# Altium schematic sheet 国赛f407vet6主控板原理图（6.26）.SchDoc
size A2
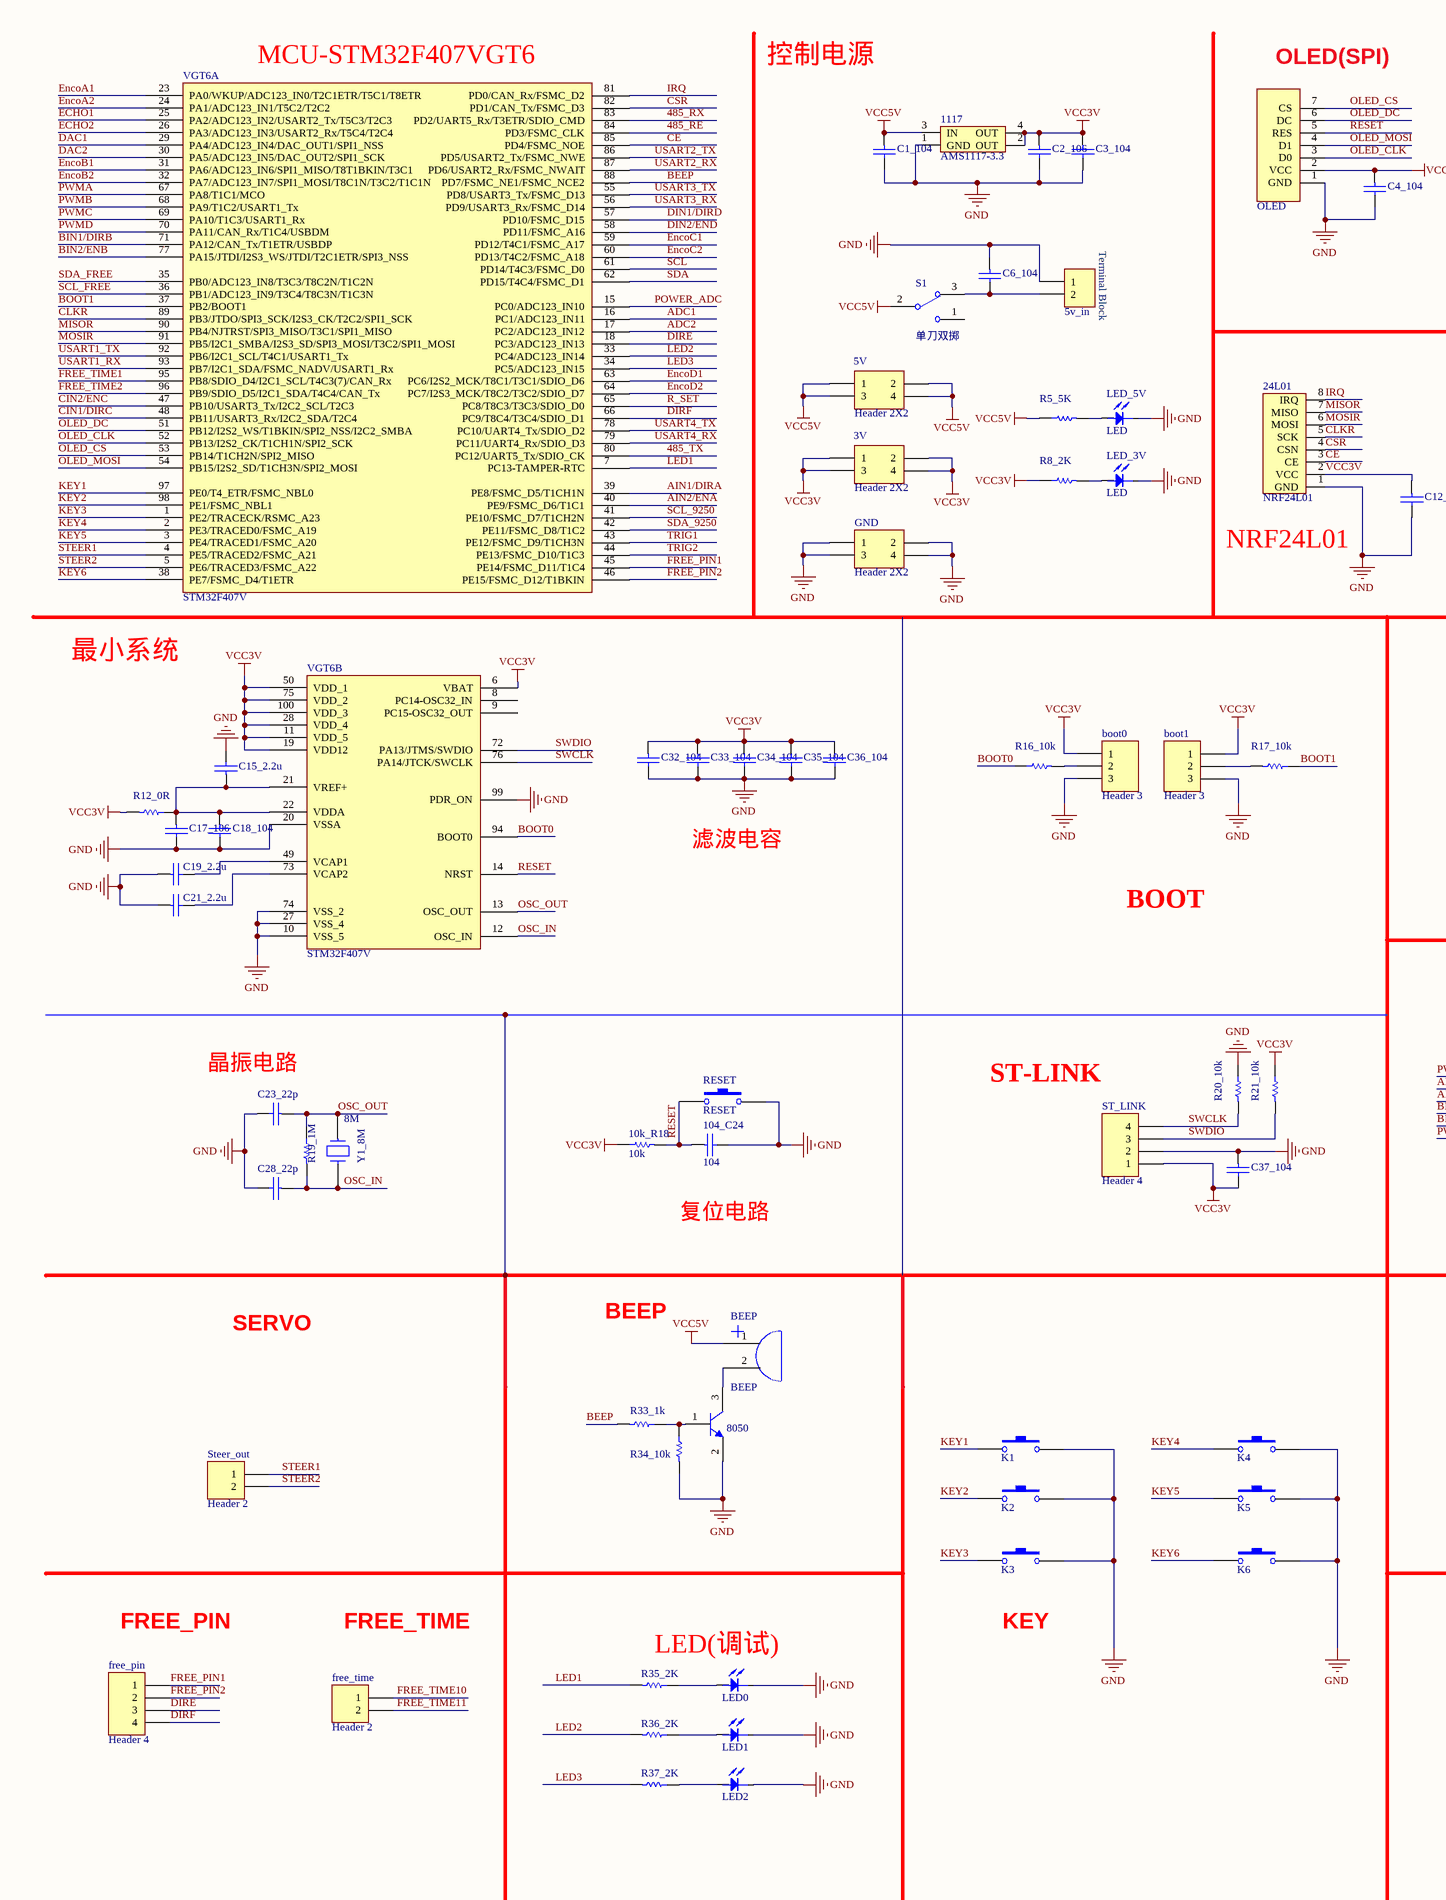
[diagram p0: 国赛f407vet6主控板原理图（6.26）.SchDoc, left]
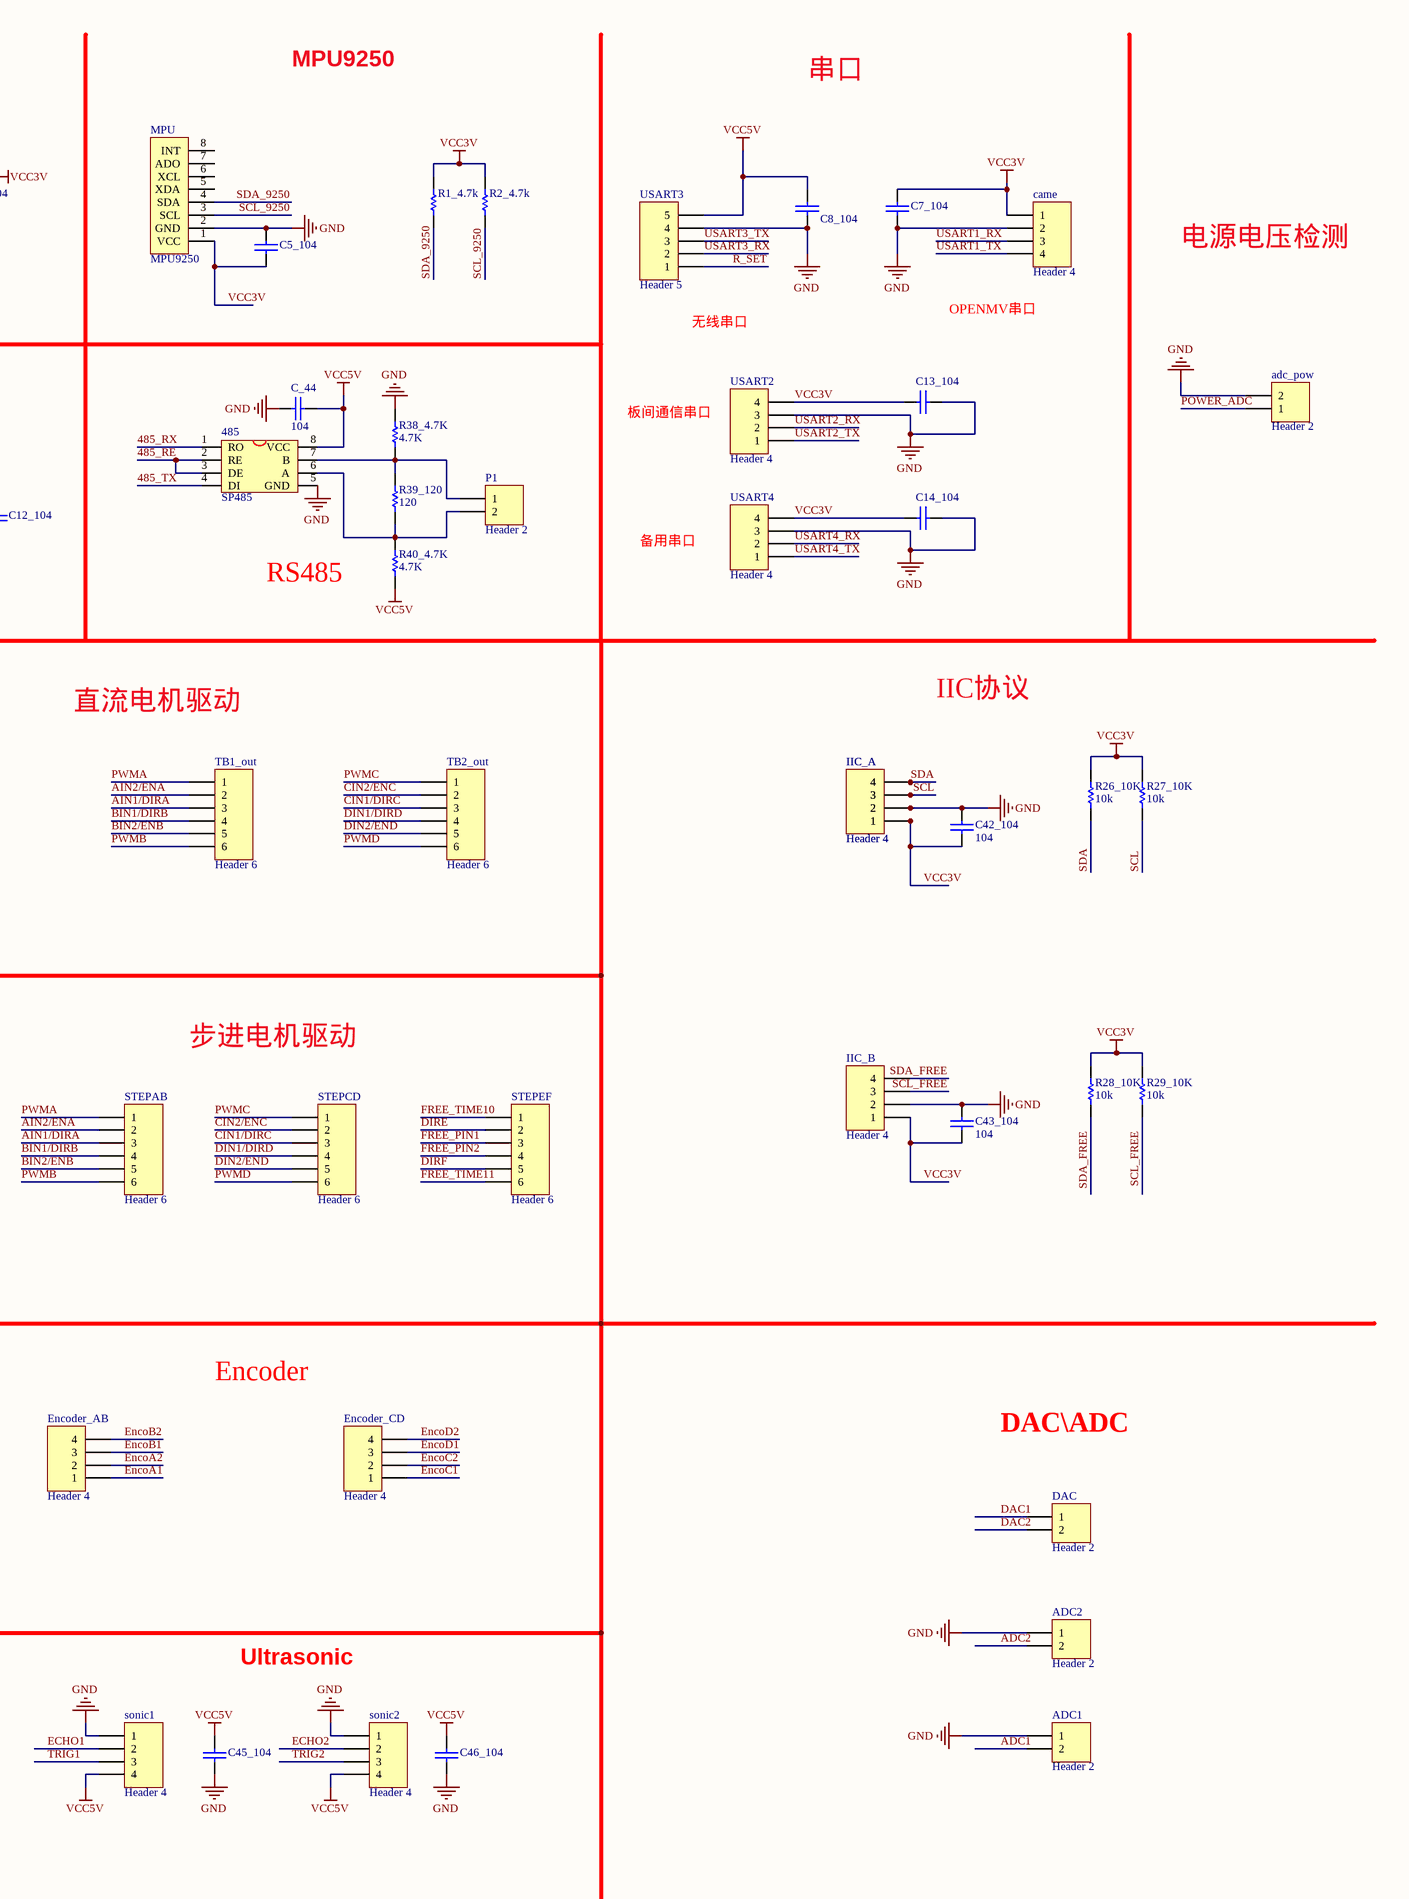
[diagram p1: 国赛f407vet6主控板原理图（6.26）.SchDoc, right]

## Parts
(Parts that share a designator on the sheet are numbered #1, #2 ... from top to bottom, then left to right.)
3V  Header 2X2  [HDR2X2]
5V  Header 2X2  [HDR2X2]
5v_in  Terminal Block 2P  [XH2.54-WS-2P]  (value not drawn)
10k_R18  RES  [0805_C]  (value not drawn)
24L01  NRF24L01  [HDR2X4]
104_C24  104  [0805_C]
485  SP485  [sop8]
1117  AMS1117-3.3  [SOT223]
8050  NPN  [SOT-23Q]  (value not drawn)
ADC1  Header 2  [XH2.54-WS-2P]
ADC2  Header 2  [XH2.54-WS-2P]
adc_pow  Header 2  [XH2.54-WS-2P]
BEEP  BEEP  [BUZZER_12.0X8.5MM]
boot0  Header 3  [HDR1X3]
boot1  Header 3  [HDR1X3]
C1_104  CAP  [0805_C]  (value not drawn)
C2_106  CAP  [0805_C]  (value not drawn)
C3_104  CAP  [0805_C]  (value not drawn)
C4_104  CAP  [0805_C]  (value not drawn)
C5_104  CAP  [0805_C]  (value not drawn)
C6_104  CAP  [0805_C]  (value not drawn)
C7_104  CAP  [0805_C]  (value not drawn)
C8_104  CAP  [0805_C]  (value not drawn)
C12_104  CAP  [0805_C]  (value not drawn)
C13_104  CAP  [0805_C]  (value not drawn)
C14_104  CAP  [0805_C]  (value not drawn)
C15_2.2u  CAP  [0805_C]  (value not drawn)
C17_106  CAP  [0805_C]  (value not drawn)
C18_104  CAP  [0805_C]  (value not drawn)
C19_2.2u  CAP  [0805_C]  (value not drawn)
C21_2.2u  CAP  [0805_C]  (value not drawn)
C23_22p  CAP  [0805_C]  (value not drawn)
C28_22p  CAP  [0805_C]  (value not drawn)
C32_104  CAP  [0805_C]  (value not drawn)
C33_104  CAP  [0805_C]  (value not drawn)
C34_104  CAP  [0805_C]  (value not drawn)
C35_104  CAP  [0805_C]  (value not drawn)
C36_104  CAP  [0805_C]  (value not drawn)
C37_104  CAP  [0805_C]  (value not drawn)
C42_104  value 104  [0805_C]  (hidden comment: CAP)
C43_104  value 104  [0805_C]  (hidden comment: CAP)
C45_104  CAP  [0805_C]  (value not drawn)
C46_104  CAP  [0805_C]  (value not drawn)
C_44  value 104  [0805_C]  (hidden comment: CAP)
came  Header 4  [XH2.54-WS-4P]
DAC  Header 2  [XH2.54-WS-2P]
Encoder_AB  Header 4  [XH2.54-WS-4P]
Encoder_CD  Header 4  [XH2.54-WS-4P]
free_pin  Header 4  [XH2.54-WS-4P]
free_time  Header 2  [XH2.54-WS-2P]
GND  Header 2X2  [HDR2X2]
IIC_A#1  Header 4  [XH2.54-WS-4P]
IIC_A#2  Header 4  [XH2.54-WS-4P]
IIC_B  Header 4  [XH2.54-WS-4P]
K1  KEY  [KEY-SMD]  (value not drawn)
K2  KEY  [KEY-SMD]  (value not drawn)
K3  KEY  [KEY-SMD]  (value not drawn)
K4  KEY  [KEY-SMD]  (value not drawn)
K5  KEY  [KEY-SMD]  (value not drawn)
K6  KEY  [KEY-SMD]  (value not drawn)
LED0  LED  [0805-LED]  (value not drawn)
LED1  LED  [0805-LED]  (value not drawn)
LED2  LED  [0805-LED]  (value not drawn)
LED_3V  LED  [0805-LED]
LED_5V  LED  [0805-LED]
MPU  MPU9250  [HDR1X4]
OLED  OLED  [HDR1X7]  (value not drawn)
P1  Header 2  [XH2.54-WS-2P]
R1_4.7k  RES  [0805_R]  (value not drawn)
R2_4.7k  RES  [0805_R]  (value not drawn)
R5_5K  RES  [0805_R]  (value not drawn)
R8_2K  RES  [0805_R]  (value not drawn)
R12_0R  RES  [0805_R]  (value not drawn)
R16_10k  RES  [0805_R]  (value not drawn)
R17_10k  RES  [0805_R]  (value not drawn)
R19_1M  RES  [0805_R]  (value not drawn)
R20_10k  RES  [0805_R]  (value not drawn)
R21_10k  RES  [0805_R]  (value not drawn)
R26_10K  value 10k  [0805_R]  (hidden comment: RES)
R27_10K  value 10k  [0805_R]  (hidden comment: RES)
R28_10K  value 10k  [0805_R]  (hidden comment: RES)
R29_10K  value 10k  [0805_R]  (hidden comment: RES)
R33_1k  RES  [0805_R]  (value not drawn)
R34_10k  RES  [0805_R]  (value not drawn)
R35_2K  RES  [0805_R]  (value not drawn)
R36_2K  RES  [0805_R]  (value not drawn)
R37_2K  RES  [0805_R]  (value not drawn)
R38_4.7K  value 4.7K  [0805_R]  (hidden comment: RES)
R39_120  value 120  [0805_R]  (hidden comment: RES)
R40_4.7K  value 4.7K  [0805_R]  (hidden comment: RES)
RESET  RESET  [KEY-SMD]
S1  单刀双掷  [SWITCH_3F_SPDT - 4.7mm]
sonic1  Header 4  [XH2.54-WS-4P]
sonic2  Header 4  [XH2.54-WS-4P]
ST_LINK  Header 4  [XH2.54-WS-4P]
Steer_out  Header 2  [XH2.54-WS-2P]
STEPAB  Header 6  [XH2.54-WS-6P]
STEPCD  Header 6  [XH2.54-WS-6P]
STEPEF  Header 6  [XH2.54-WS-6P]
TB1_out  Header 6  [XH2.54-WS-6P]
TB2_out  Header 6  [XH2.54-WS-6P]
USART2  Header 4  [XH2.54-WS-4P]
USART3  Header 5  [XH2.54-WS-5P]
USART4  Header 4  [XH2.54-WS-4P]
VGT6  STM32F407V  [LQFP-100]  (parts A,B of 2)
Y1_8M  8M  [1812_R]

## Nets
GND: 5v_in.1 24L01.1(GND) 104_C24.2 485.5(GND) 1117.1(GND) 8050.2(E) ADC1.1 ADC2.1 adc_pow.2 boot0.3 boot1.3 C1_104.2 C2_106.2 C3_104.2 C4_104.2 C5_104.1 C6_104.1 C7_104.2 C8_104.1 C12_104.2 C13_104.2 C14_104.2 C15_2.2u.2 C17_106.2 C18_104.2 C19_2.2u.1 C21_2.2u.1 C23_22p.2 C28_22p.2 C32_104.2 C33_104.2 C34_104.2 C35_104.2 C36_104.2 C37_104.1 C42_104.1 C43_104.1 C45_104.2 C46_104.2 C_44.2 came.2 GND.1 GND.2 GND.3 GND.4 IIC_A#1.2 IIC_A#2.2 IIC_B.2 K1.2 K2.2 K3.2 K4.2 K5.2 K6.2 LED0.K LED1.K LED2.K LED_3V.K LED_5V.K MPU.2(GND) OLED.1(GND) R20_10k.2(TOP) R34_10k.1(BOT) R38_4.7K.2(TOP) RESET.2 sonic1.1 sonic2.1 ST_LINK.2 USART2.3 USART3.4 USART4.3 VGT6.10(VSS_5) VGT6.20(VSSA) VGT6.27(VSS_4) VGT6.74(VSS_2) VGT6.99(PDR_ON)
VCC3V: 3V.1 3V.2 3V.3 3V.4 10k_R18.2(TOP) 24L01.2(VCC) 1117.2(OUT) 1117.4(OUT) boot0.1 boot1.1 C2_106.1 C3_104.1 C4_104.1 C5_104.2 C7_104.1 C12_104.1 C13_104.1 C14_104.1 C32_104.1 C33_104.1 C34_104.1 C35_104.1 C36_104.1 C37_104.2 C42_104.2 C43_104.2 came.1 IIC_A#1.1 IIC_A#2.1 IIC_B.1 MPU.1(VCC) OLED.2(VCC) R1_4.7k.2(TOP) R2_4.7k.2(TOP) R8_2K.2(TOP) R12_0R.1(BOT) R21_10k.2(TOP) R26_10K.2(TOP) R27_10K.2(TOP) R28_10K.2(TOP) R29_10K.2(TOP) ST_LINK.1 USART2.4 USART4.4 VGT6.6(VBAT) VGT6.11(VDD_5) VGT6.19(VDD12) VGT6.28(VDD_4) VGT6.50(VDD_1) VGT6.75(VDD_2) VGT6.100(VDD_3)
VCC5V: 5V.1 5V.2 5V.3 5V.4 485.8(VCC) 1117.3(IN) BEEP.1 C1_104.1 C8_104.2 C45_104.1 C46_104.1 C_44.1 R5_5K.2(TOP) R40_4.7K.1(BOT) S1.2 sonic1.4 sonic2.4 USART3.5
485_RE: 485.2(RE) 485.3(DE) VGT6.84(PD3/FSMC_CLK)
485_RX: 485.1(RO) VGT6.83(PD2/UART5_Rx/T3ETR/SDIO_CMD)
485_TX: 485.4(DI) VGT6.80(PC12/UART5_Tx/SDIO_CK)
ADC1: ADC1.2 VGT6.16(PC1/ADC123_IN11)
ADC2: ADC2.2 VGT6.17(PC2/ADC123_IN12)
AIN1/DIRA: STEPAB.3 TB1_out.3 VGT6.39(PE8/FSMC_D5/T1CH1N)
AIN2/ENA: STEPAB.2 TB1_out.2 VGT6.40(PE9/FSMC_D6/T1C1)
BEEP: R33_1k.1(BOT) VGT6.88(PD7/FSMC_NE1/FSMC_NCE2)
BIN1/DIRB: STEPAB.4 TB1_out.4 VGT6.71(PA12/CAN_Tx/T1ETR/USBDP)
BIN2/ENB: STEPAB.5 TB1_out.5 VGT6.77(PA15/JTDI/I2S3_WS/JTDI/T2C1ETR/SPI3_NSS)
BOOT0: R16_10k.2(TOP) VGT6.94(BOOT0)
BOOT1: R17_10k.2(TOP) VGT6.37(PB2/BOOT1)
CE: 24L01.3(CE) VGT6.85(PD4/FSMC_NOE)
CIN1/DIRC: STEPCD.3 TB2_out.3 VGT6.48(PB11/USART3_Rx/I2C2_SDA/T2C4)
CIN2/ENC: STEPCD.2 TB2_out.2 VGT6.47(PB10/USART3_Tx/I2C2_SCL/T2C3)
CLKR: 24L01.5(SCK) VGT6.89(PB3/JTDO/SPI3_SCK/I2S3_CK/T2C2/SPI1_SCK)
CSR: 24L01.4(CSN) VGT6.82(PD1/CAN_Tx/FSMC_D3)
DAC1: DAC.1 VGT6.29(PA4/ADC123_IN4/DAC_OUT1/SPI1_NSS)
DAC2: DAC.2 VGT6.30(PA5/ADC123_IN5/DAC_OUT2/SPI1_SCK)
DIN1/DIRD: STEPCD.4 TB2_out.4 VGT6.57(PD10/FSMC_D15)
DIN2/END: STEPCD.5 TB2_out.5 VGT6.58(PD11/FSMC_A16)
DIRE: free_pin.3 STEPEF.2 VGT6.18(PC3/ADC123_IN13)
DIRF: free_pin.4 STEPEF.5 VGT6.66(PC9/T8C4/T3C4/SDIO_D1)
ECHO1: sonic1.2 VGT6.25(PA2/ADC123_IN2/USART2_Tx/T5C3/T2C3)
ECHO2: sonic2.2 VGT6.26(PA3/ADC123_IN3/USART2_Rx/T5C4/T2C4)
EncoA1: Encoder_AB.1 VGT6.23(PA0/WKUP/ADC123_IN0/T2C1ETR/T5C1/T8ETR)
EncoA2: Encoder_AB.2 VGT6.24(PA1/ADC123_IN1/T5C2/T2C2)
EncoB1: Encoder_AB.3 VGT6.31(PA6/ADC123_IN6/SPI1_MISO/T8T1BKIN/T3C1)
EncoB2: Encoder_AB.4 VGT6.32(PA7/ADC123_IN7/SPI1_MOSI/T8C1N/T3C2/T1C1N)
EncoC1: Encoder_CD.1 VGT6.59(PD12/T4C1/FSMC_A17)
EncoC2: Encoder_CD.2 VGT6.60(PD13/T4C2/FSMC_A18)
EncoD1: Encoder_CD.3 VGT6.63(PC6/I2S2_MCK/T8C1/T3C1/SDIO_D6)
EncoD2: Encoder_CD.4 VGT6.64(PC7/I2S3_MCK/T8C2/T3C2/SDIO_D7)
FREE_PIN1: free_pin.1 STEPEF.3 VGT6.45(PE14/FSMC_D11/T1C4)
FREE_PIN2: free_pin.2 STEPEF.4 VGT6.46(PE15/FSMC_D12/T1BKIN)
FREE_TIME1: VGT6.95(PB8/SDIO_D4/I2C1_SCL/T4C3(7)/CAN_Rx)
FREE_TIME2: VGT6.96(PB9/SDIO_D5/I2C1_SDA/T4C4/CAN_Tx)
FREE_TIME10: free_time.1 STEPEF.1
FREE_TIME11: free_time.2 STEPEF.6
IRQ: 24L01.8(IRQ) VGT6.81(PD0/CAN_Rx/FSMC_D2)
KEY1: K1.1 VGT6.97(PE0/T4_ETR/FSMC_NBL0)
KEY2: K2.1 VGT6.98(PE1/FSMC_NBL1)
KEY3: K3.1 VGT6.1(PE2/TRACECK/RSMC_A23)
KEY4: K4.1 VGT6.2(PE3/TRACED0/FSMC_A19)
KEY5: K5.1 VGT6.3(PE4/TRACED1/FSMC_A20)
KEY6: K6.1 VGT6.38(PE7/FSMC_D4/T1ETR)
LED1: R35_2K.1(BOT) VGT6.7(PC13-TAMPER-RTC)
LED2: R36_2K.1(BOT) VGT6.33(PC4/ADC123_IN14)
LED3: R37_2K.1(BOT) VGT6.34(PC5/ADC123_IN15)
MISOR: 24L01.7(MISO) VGT6.90(PB4/NJTRST/SPI3_MISO/T3C1/SPI1_MISO)
MOSIR: 24L01.6(MOSI) VGT6.91(PB5/I2C1_SMBA/I2S3_SD/SPI3_MOSI/T3C2/SPI1_MOSI)
OLED_CLK: OLED.3(D0) VGT6.52(PB13/I2S2_CK/T1CH1N/SPI2_SCK)
OLED_CS: OLED.7(CS) VGT6.53(PB14/T1CH2N/SPI2_MISO)
OLED_DC: OLED.6(DC) VGT6.51(PB12/I2S2_WS/T1BKIN/SPI2_NSS/I2C2_SMBA)
OLED_MOSI: OLED.4(D1) VGT6.54(PB15/I2S2_SD/T1CH3N/SPI2_MOSI)
OSC_IN: C28_22p.1 R19_1M.1(BOT) VGT6.12(OSC_IN) Y1_8M.2
OSC_OUT: C23_22p.1 R19_1M.2(TOP) VGT6.13(OSC_OUT) Y1_8M.1
POWER_ADC: adc_pow.1 VGT6.15(PC0/ADC123_IN10)
PWMA: STEPAB.1 TB1_out.1 VGT6.67(PA8/T1C1/MCO)
PWMB: STEPAB.6 TB1_out.6 VGT6.68(PA9/T1C2/USART1_Tx)
PWMC: STEPCD.1 TB2_out.1 VGT6.69(PA10/T1C3/USART1_Rx)
PWMD: STEPCD.6 TB2_out.6 VGT6.70(PA11/CAN_Rx/T1C4/USBDM)
R_SET: USART3.1 VGT6.65(PC8/T8C3/T3C3/SDIO_D0)
RESET: 10k_R18.1(BOT) 104_C24.1 OLED.5(RES) RESET.1 VGT6.14(NRST)
SCL: IIC_A#1.3 IIC_A#2.3 R27_10K.1(BOT) VGT6.61(PD14/T4C3/FSMC_D0)
SCL_9250: MPU.3(SCL) R2_4.7k.1(BOT) VGT6.41(PE10/FSMC_D7/T1CH2N)
SCL_FREE: IIC_B.3 R29_10K.1(BOT) VGT6.36(PB1/ADC123_IN9/T3C4/T8C3N/T1C3N)
SDA: IIC_A#1.4 IIC_A#2.4 R26_10K.1(BOT) VGT6.62(PD15/T4C4/FSMC_D1)
SDA_9250: MPU.4(SDA) R1_4.7k.1(BOT) VGT6.42(PE11/FSMC_D8/T1C2)
SDA_FREE: IIC_B.4 R28_10K.1(BOT) VGT6.35(PB0/ADC123_IN8/T3C3/T8C2N/T1C2N)
STEER1: Steer_out.1 VGT6.4(PE5/TRACED2/FSMC_A21)
STEER2: Steer_out.2 VGT6.5(PE6/TRACED3/FSMC_A22)
SWCLK: R20_10k.1(BOT) ST_LINK.4 VGT6.76(PA14/JTCK/SWCLK)
SWDIO: R21_10k.1(BOT) ST_LINK.3 VGT6.72(PA13/JTMS/SWDIO)
TRIG1: sonic1.3 VGT6.43(PE12/FSMC_D9/T1CH3N)
TRIG2: sonic2.3 VGT6.44(PE13/FSMC_D10/T1C3)
USART1_RX: came.3 VGT6.93(PB7/I2C1_SDA/FSMC_NADV/USART1_Rx)
USART1_TX: came.4 VGT6.92(PB6/I2C1_SCL/T4C1/USART1_Tx)
USART2_RX: USART2.2 VGT6.87(PD6/USART2_Rx/FSMC_NWAIT)
USART2_TX: USART2.1 VGT6.86(PD5/USART2_Tx/FSMC_NWE)
USART3_RX: USART3.2 VGT6.56(PD9/USART3_Rx/FSMC_D14)
USART3_TX: USART3.3 VGT6.55(PD8/USART3_Tx/FSMC_D13)
USART4_RX: USART4.2 VGT6.79(PC11/UART4_Rx/SDIO_D3)
USART4_TX: USART4.1 VGT6.78(PC10/UART4_Tx/SDIO_D2)
Net5v_in_2: 5v_in.2 C6_104.2 S1.3
Net485_6: 485.6(A) P1.2 R39_120.1(BOT) R40_4.7K.2(TOP)
Net485_7: 485.7(B) P1.1 R38_4.7K.1(BOT) R39_120.2(TOP)
Net8050_1: 8050.1(B) R33_1k.2(TOP) R34_10k.2(TOP)
Net8050_3: 8050.3(C) BEEP.2
Netboot0_2: boot0.2 R16_10k.1(BOT)
Netboot1_2: boot1.2 R17_10k.1(BOT)
NetC15_2.2u_1: C15_2.2u.1 C17_106.1 C18_104.1 R12_0R.2(TOP) VGT6.21(VREF+) VGT6.22(VDDA)
NetC19_2.2u_2: C19_2.2u.2 VGT6.49(VCAP1)
NetC21_2.2u_2: C21_2.2u.2 VGT6.73(VCAP2)
NetLED0_A: LED0.A R35_2K.2(TOP)
NetLED1_A: LED1.A R36_2K.2(TOP)
NetLED2_A: LED2.A R37_2K.2(TOP)
NetLED_3V_A: LED_3V.A R8_2K.1(BOT)
NetLED_5V_A: LED_5V.A R5_5K.1(BOT)

Not connected (* = marked no-connect by the designer): MPU 5(XDA) 6(XCL) 7(ADO) 8(INT); S1 1; VGT6 8(PC14-OSC32_IN) 9(PC15-OSC32_OUT)

## Notes on the sheet
- (near VGT6) MCU-STM32F407VGT6
- 控制电源
- (near OLED) OLED(SPI)
- MPU9250
- 串口
- 电源电压检测
- (near USART3) 无线串口
- OPENMV串口
- 板间通信串口
- 备用串口
- (near 24L01) NRF24L01
- RS485
- 最小系统
- 直流电机驱动
- IIC协议
- 滤波电容
- BOOT
- 步进电机驱动
- (near C23_22p) 晶振电路
- ST-LINK
- 复位电路
- SERVO
- BEEP
- Encoder
- DAC\ADC
- FREE_PIN
- FREE_TIME
- LED(调试)
- KEY
- Ultrasonic
- (in symbol RES) 10k
- (in symbol Terminal Block 2P) Terminal Block

## Library data of the parts
3V 5V GND = Header 2X2: Header, 2-Pin, Dual row; LatestRevisionDate: 17-Jul-2002; LatestRevisionNote: Re-released for DXP Platform.; Publisher: Altium Limited
104_C24 = CAP: Value: 104
485 = MAX3485: RS485
1117 = AMS1117
ADC1 ADC2 adc_pow DAC free_time P1 Steer_out = Header 2: Header, 2-Pin; LatestRevisionDate: 17-Jul-2002; LatestRevisionNote: Re-released for DXP Platform.; Publisher: Altium Limited
BEEP = BEEP: 蜂鸣器
boot0 boot1 = Header 3: Header, 3-Pin; LatestRevisionDate: 17-Jul-2002; LatestRevisionNote: Re-released for DXP Platform.; Publisher: Altium Limited
came Encoder_AB Encoder_CD free_pin IIC_A#1 IIC_A#2 IIC_B sonic1 sonic2 ST_LINK USART2 USART4 = Header 4: Header, 4-Pin; LatestRevisionDate: 17-Jul-2002; LatestRevisionNote: Re-released for DXP Platform.; Publisher: Altium Limited
MPU = MPU6050
OLED = OLED_SPI_1
RESET = KEY
S1 = SW-SPDT: 开关; Published: 24-Mar-1999; LatestRevisionDate: 17-Dec-2003; LatestRevisionNote: Schematic revised, PCB Footprint replaced.; DatasheetDocument: 05-Dec-2000; PackageReference: TL36WW15050; Publisher: Altium Limited; ComponentLink1Description: Manufacturer Link; ComponentLink1URL: http://www.apem.com
STEPAB STEPCD STEPEF TB1_out TB2_out = Header 6: Header, 6-Pin; LatestRevisionDate: 17-Jul-2002; LatestRevisionNote: Re-released for DXP Platform.; Publisher: Altium Limited
USART3 = Header 5: Header, 5-Pin; LatestRevisionDate: 17-Jul-2002; LatestRevisionNote: Re-released for DXP Platform.; Publisher: Altium Limited
VGT6 = STM32F407V: STM32单片机100引脚
Y1_8M = CRYSTAL